# EAGLE design attiny84_tester-mk-1.0 (EAGLE 6.5.0)
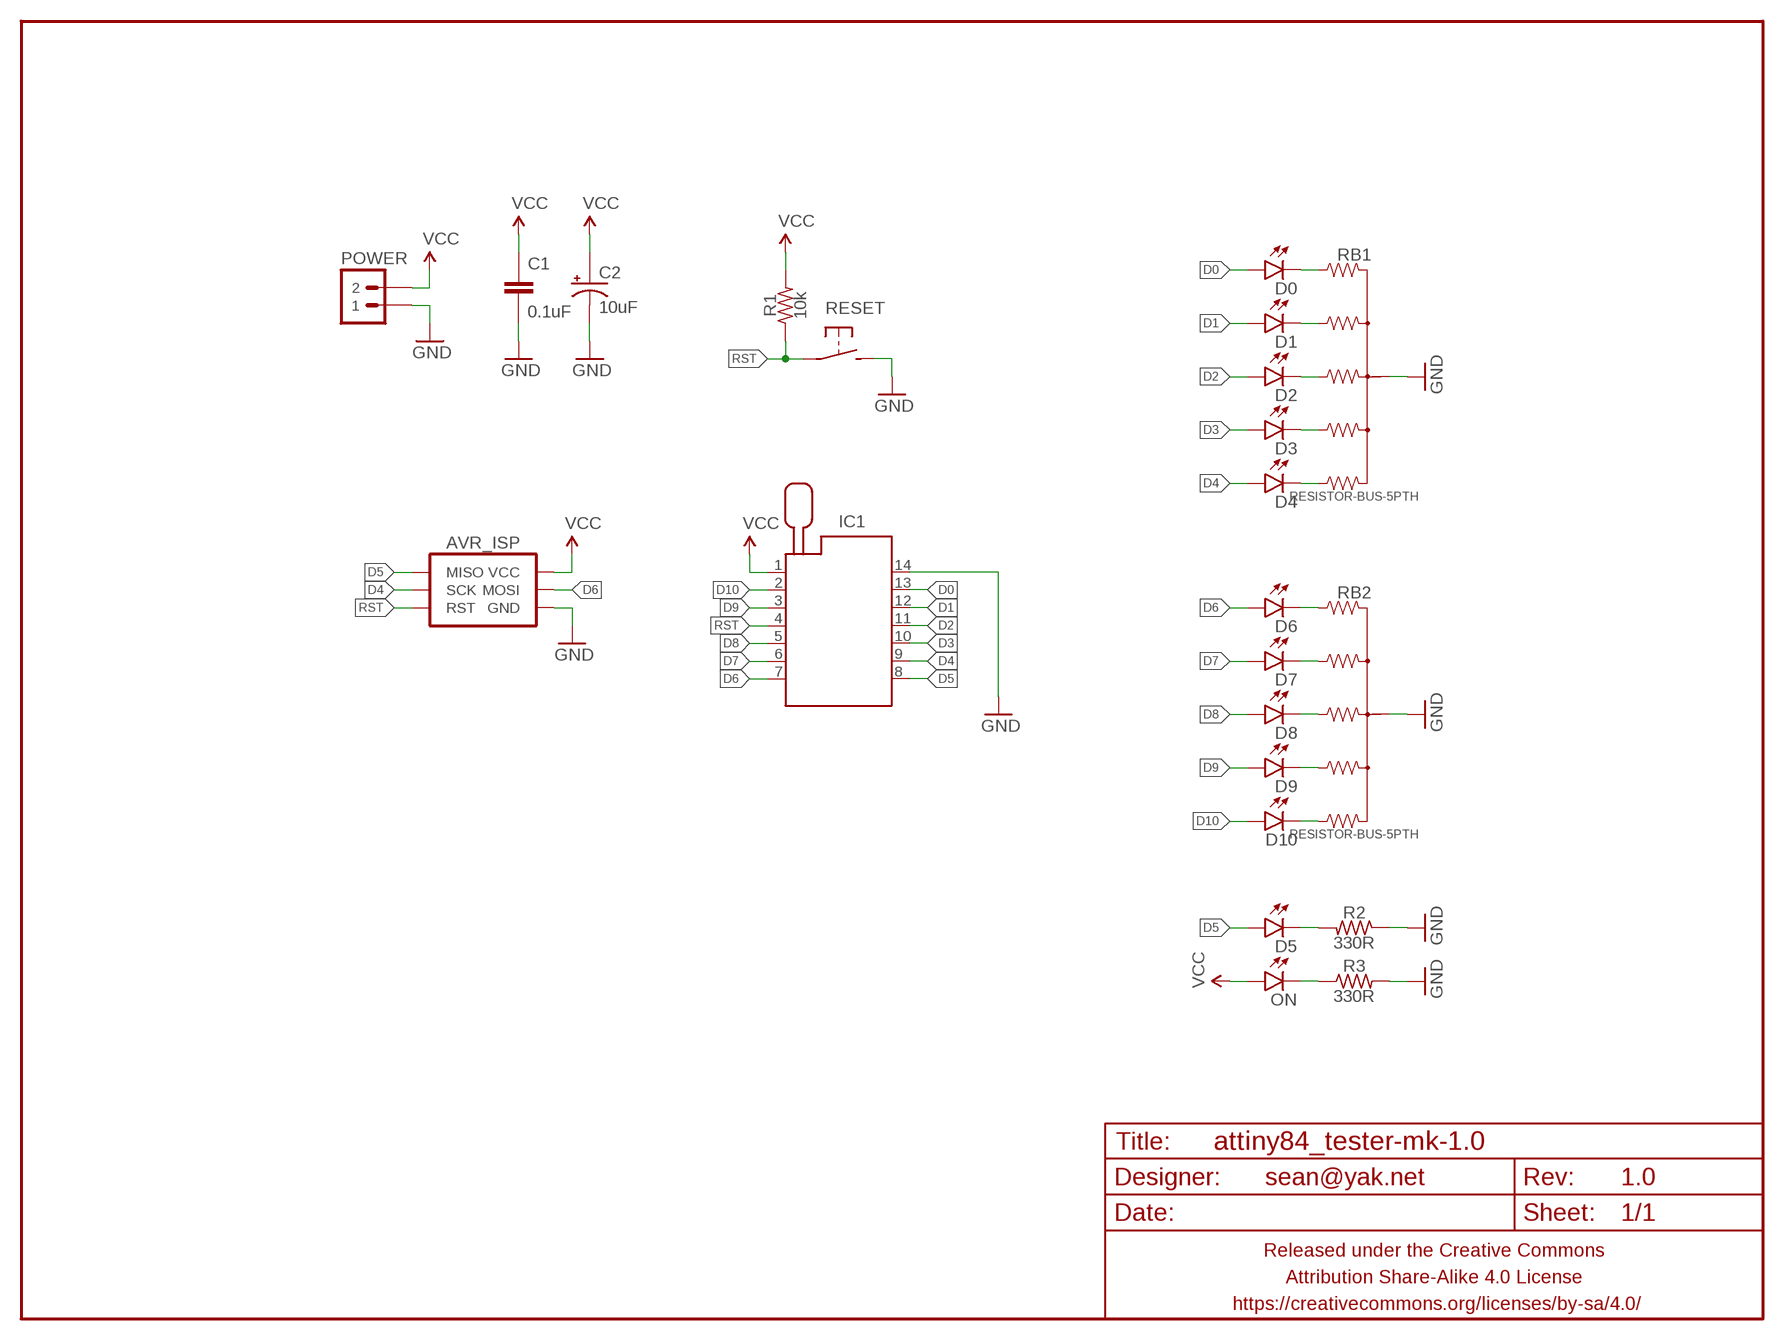
[diagram p0: schematic, sheet 1]

## Parts
AVR_ISP  AVR_SPI_PRG_6PTH-SHROUD  [2X3-SHROUDED]
C1  0.1uF  CAPACITOR-CERAMIC025-024X044  [C025-024X044]
C2  10uF  CAPACITOR-POLARIZEDE2-5  [E2-5]
D0  LED3MM-LESS  [LED3MM-LESSSILK]
D1  LED3MM-LESS  [LED3MM-LESSSILK]
D2  LED3MM-LESS  [LED3MM-LESSSILK]
D3  LED3MM-LESS  [LED3MM-LESSSILK]
D4  LED3MM-LESS  [LED3MM-LESSSILK]
D5  LED3MM-LESS  [LED3MM-LESSSILK]
D6  LED3MM-LESS  [LED3MM-LESSSILK]
D7  LED3MM-LESS  [LED3MM-LESSSILK]
D8  LED3MM-LESS  [LED3MM-LESSSILK]
D9  LED3MM-LESS  [LED3MM-LESSSILK]
D10  LED3MM-LESS  [LED3MM-LESSSILK]
FRAME1  FRAME-LETTERNO_PACKAGE  [DUMMY]
IC1  ATTiny84  ZIF14  [ZIF14]
ON  LED3MM-LESS  [LED3MM-LESSSILK]
POWER  M02PTH-CENTERED-R+  [1X02-CENTER-R+]
R1  10k  RESISTORPTH-AXIAL-5.08MM  [RESISTOR-AXIAL-PTH-5.08MM]
R2  330R  RESISTORPTH-AXIAL-5.08MM  [RESISTOR-AXIAL-PTH-5.08MM]
R3  330R  RESISTORPTH-AXIAL-5.08MM  [RESISTOR-AXIAL-PTH-5.08MM]
RB1  RESISTOR-BUS-5PTH  [1X06]
RB2  RESISTOR-BUS-5PTH  [1X06]
RESET  SPST-NO-TACT6MM-PTH-SMALL-PADS  [DTS-6-SMALL-PADS]

## Nets
D0: D0.A IC1.13
D1: D1.A IC1.12
D2: D2.A IC1.11
D3: D3.A IC1.10
D4: AVR_ISP.3(SCK) D4.A IC1.9
D5: AVR_ISP.1(MISO) D5.A IC1.8
D6: AVR_ISP.4(MOSI) D6.A IC1.7
D7: D7.A IC1.6
D8: D8.A IC1.5
D9: D9.A IC1.3
D10: D10.A IC1.2
GND: AVR_ISP.6(GND) C1.2 C2.- IC1.14 POWER.1 R2.P$1 R3.P$2 RB1.6(COM) RB2.6(COM) RESET.3 RESET.4
N$1: ON.K(C) R3.P$1
N$2: D0.K(C) RB1.1
N$3: D1.K(C) RB1.2
N$4: D2.K(C) RB1.3
N$5: D3.K(C) RB1.4
N$6: D4.K(C) RB1.5
N$7: D5.K(C) R2.P$2
N$8: D6.K(C) RB2.1
N$9: D7.K(C) RB2.2
N$10: D8.K(C) RB2.3
N$11: D9.K(C) RB2.4
N$12: D10.K(C) RB2.5
RST: AVR_ISP.5(RST) IC1.4 R1.P$1 RESET.1 RESET.2
VCC: AVR_ISP.2(VCC) C1.1 C2.+ IC1.1 ON.A POWER.2 R1.P$2

## Library data of the parts
AVR_ISP = A_butts:AVR_SPI_PRG_6: AVR ISP 6 Pin This is the reduced ISP connector for AVR programming. Common on Arduino. This footprint will take up less PCB space and can be used with a 10-pin to 6-pin adapter such as SKU: BOB-08508 **Special note about "TEST_POINT" package. The stop mask is on the top side, so if you want your programming test points to be on the bottom of your board, make sure to place this package on the bottom side of the board. This also ensure that the orientation to program from the bottom side will be correct.
C1 = A_butts:CAPACITOR-CERAMIC: CAPACITOR, European symbol
C2 = A_butts:CAPACITOR-POLARIZED: POLARIZED CAPACITOR, American symbol
D0 D1-D10 ON = A_butts:LED: LEDs Standard schematic elements and footprints for 5mm, 3mm, 1206, and 0603 sized LEDs. 5mm - Spark Fun Electronics SKU : COM-00529 (and others)
FRAME1 = A_butts:FRAME-LETTER: Schematic Frame Standard 8.5x11 US Letter frame; DESIGNER: sean@yak.net; VERSION: 1.0
IC1 = A_butts:ZIF14: Zero Insertion Force Socked Source: http://www.3M.com/ehpd; MF: 3M; MPN: 214-3339-00-0602J; OC_FARNELL: 1247151; OC_NEWARK: 85K7793
POWER = A_butts:M02: Standard 2-pin 0.1" header. Use with - straight break away headers ( PRT-00116) - right angle break away headers (PRT-00553) - swiss pins (PRT-00743) - machine pins (PRT-00117) - female headers (PRT-00115) Molex polarized connector foot print use with: PRT-08233 with associated crimp pins and housings. 2.54_SCREWTERM for use with PRT-10571. 3.5mm Screw Terminal footprints for PRT-08084 5mm Screw Terminal footprints for use with PRT-08433
R1-R3 = A_butts:RESISTOR: RESISTOR, American symbol
RB1 RB2 = A_butts:RESISTOR-BUS-5
RESET = A_butts:SPST-NO-TACT

## Board
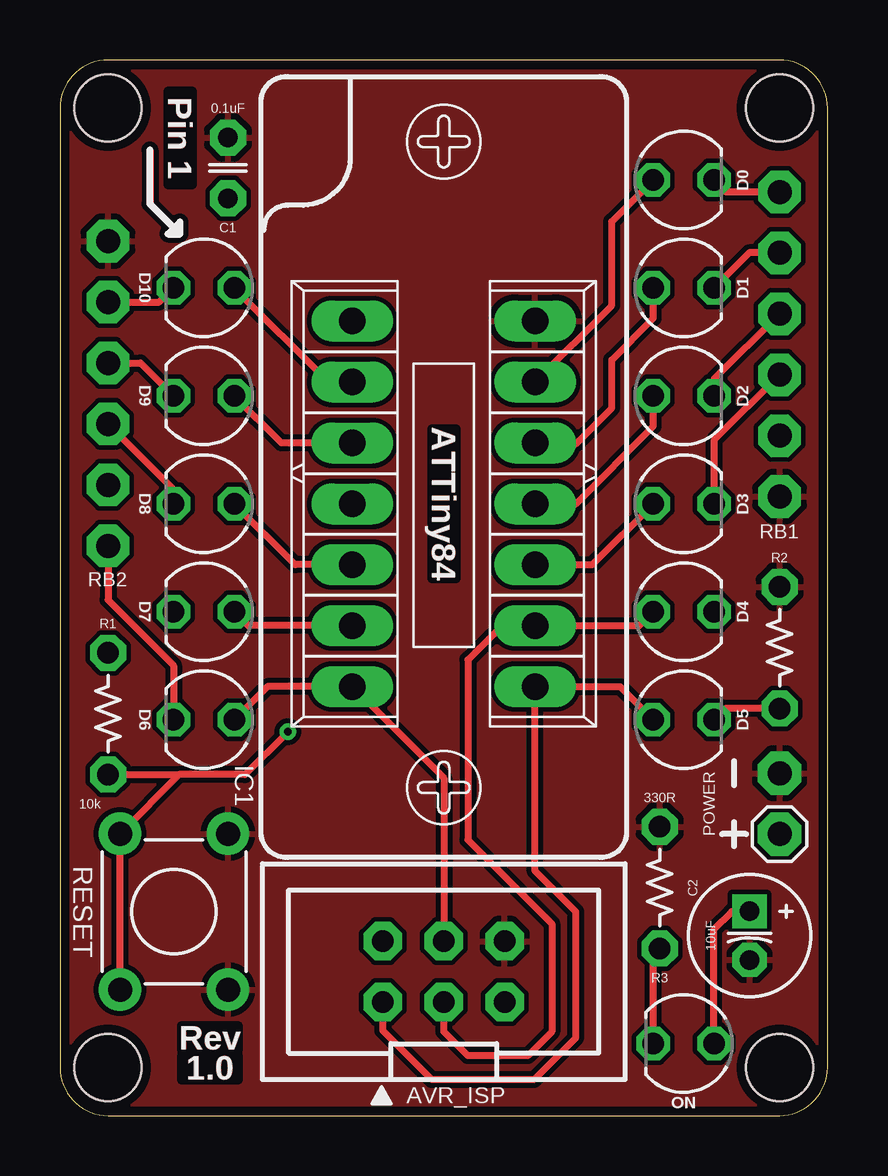
[diagram p1: board, top side]
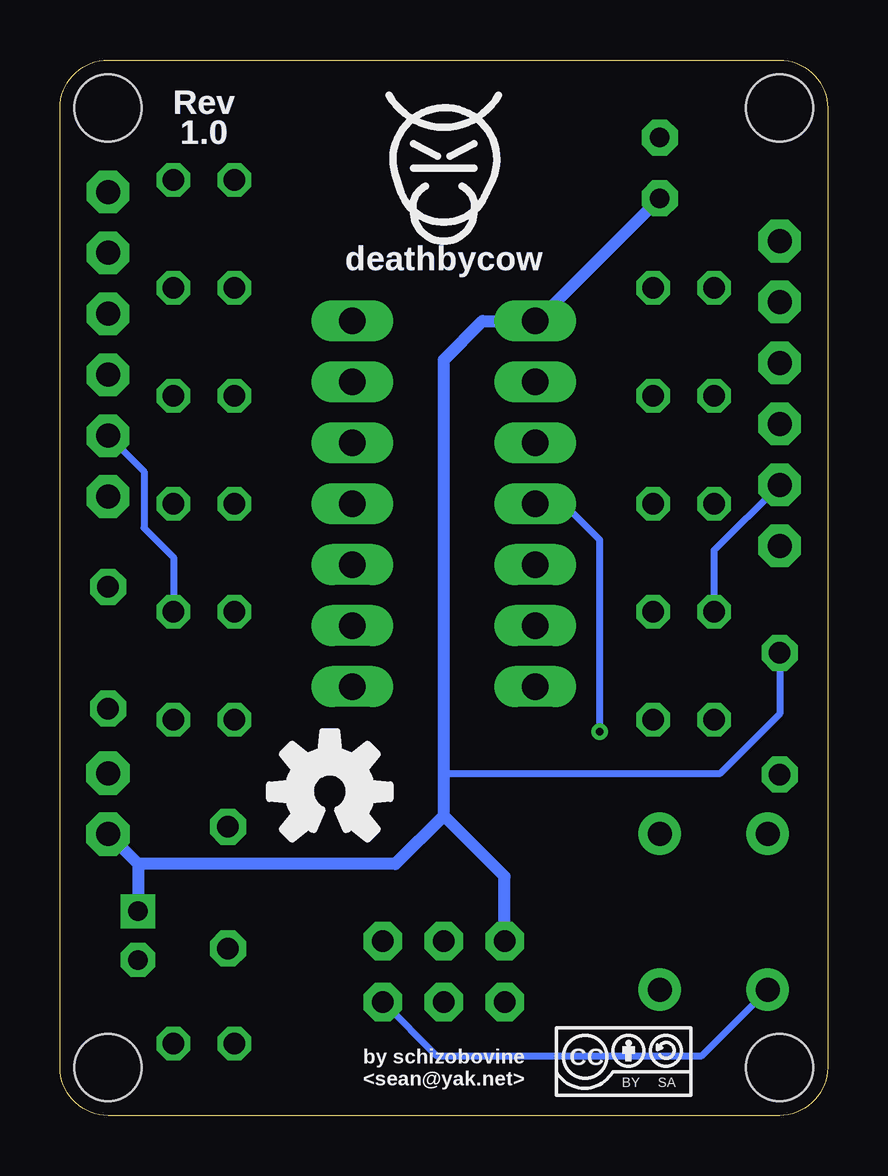
[diagram p2: board, bottom side, seen from below]

Size 32 x 44 mm. Coordinates in mm from the lower left corner, seen from the top.
Outline: 0,42 0,2 arc90 2,0 30,0 arc90 32,2 32,42 arc90 30,44 2,44 arc90 0,42
Copper layers (1*16): Top 0.0356mm / dielectric 1.5011mm / Bottom 0.0356mm
Design rules "LaenPCBOrder_2": minimum track width 6mil, minimum drill 13mil, track to track 6mil, track to pad 6mil, pad to pad 6mil, via to via 6mil, smd to smd 6mil, copper to edge 15mil, drill to drill 6mil, minimum pad ring 7mil, minimum via ring 7mil, stop-mask expansion 3mil, vias tented up to drill 20mil, thermal gap 10mil
Holes 2.8 mm at 2,2 30,2 30,42 2,42

### Footprints (pad centres in the part's own frame; a part is rotated, then mirrored left to right if it is on the bottom)
2X3-SHROUDED = drill 0.9 pad 1.6 octagon: 1 -1.27,2.54; 2 1.27,2.54; 3 -1.27,0; 4 1.27,0; 5 -1.27,-2.54; 6 1.27,-2.54
C025-024X044 = drill 0.813 pad 1.5 octagon: 1 -1.27,0; 2 1.27,0
E2-5 = drill 0.813 pad 1.422 square: + -1.016,0 | drill 0.813 pad 1.422 octagon: - 1.016,0
LED3MM-LESSSILK = drill 0.9 pad 1.4 octagon: A -1.27,0; K 1.27,0
ZIF14 = drill 1.1 pad 1.7 long: 1 -7.62,-3.81; 2 -5.08,-3.81; 3 -2.54,-3.81; 4 0,-3.81; 5 2.54,-3.81; 6 5.08,-3.81; 7 7.62,-3.81; 8 7.62,3.81; 9 5.08,3.81; 10 2.54,3.81; 11 0,3.81; 12 -2.54,3.81; 13 -5.08,3.81; 14 -7.62,3.81
1X02-CENTER-R+ = drill 1 pad 1.8 octagon: 1 -1.27,0; 2 1.27,0
RESISTOR-AXIAL-PTH-5.08MM = drill 0.9 pad 1.5 octagon: P$1 -2.54,0; P$2 2.54,0
1X06 = drill 1 pad 1.778 octagon: 1 0,0; 2 2.54,0; 3 5.08,0; 4 7.62,0; 5 10.16,0; 6 12.7,0
DTS-6-SMALL-PADS = drill 1 pad 1.778: 1 -3.25,2.25; 2 3.25,2.25; 3 -3.25,-2.25; 4 3.25,-2.25

### Placement (x,y rotation side)
AVR_ISP  16,6 90 top
C1  7,39.5 90 top
C2  28.75,7.5 270 top
D0  26,39 0 top
D1  26,34.5 0 top
D2  26,30 0 top
D3  26,25.5 0 top
D4  26,21 0 top
D5  26,16.5 0 top
D6  6,16.5 180 top
D7  6,21 180 top
D8  6,25.5 180 top
D9  6,30 180 top
D10  6,34.5 180 top
FRAME1  0.5,0.5 0 top
IC1  16,25.5 270 top
ON  26,3 180 top
POWER  30,13 270 top
R1  2,16.75 90 top
R2  30,19.5 270 top
R3  25,9.5 90 top
RB1  30,38.5 270 top
RB2  2,23.75 90 top
RESET  4.75,8.5 90 top
U$1  [COW_SMALL_METAL]  16,40 0 bottom
U$2  [CC-BY-SA-4.0-NO-URL]  8.5,2.25 0 bottom
U$3  [OSHWLOGO_BOT_0.2_A]  20.75,13.5 0 top

### Tracks (layer width: path | path; a pad name or v marks a point on that pad's centre or on a via)
D0
  Top 0.3: IC1.13 23,33.77 23,37.27 D0.A
D1
  Top 0.3: IC1.12 19.85,28 21.5,28 23,29.5 23,31.5 24.73,33.23 D1.A
D2
  Top 0.3: IC1.11 21.5,25.5 24.73,28.73 D2.A
D3
  Top 0.3: IC1.10 22.19,22.96 D3.A
D4
  Top 0.3: D4.A 24.15,20.42 IC1.9 19.73,20.5 18.5,20.5 17,19 17,11.5 20.5,8 20.5,3.5 19.5,2.5 17,2.5 16,3.5 AVR_ISP.3
D5
  Top 0.3: D5.A 23.35,17.88 IC1.8 19.81,10.19 21.5,8.5 21.5,3.25 19.75,1.5 15.5,1.5 13.46,3.54 AVR_ISP.1
D6
  Top 0.3: D6.A 8.65,17.88 IC1.7 16,14.07 AVR_ISP.4
D7
  Top 0.3: IC1.6 7.85,20.42 D7.A
D8
  Top 0.3: IC1.5 9.81,22.96 D8.A
D9
  Top 0.3: IC1.3 9.23,28.04 D9.A
D10
  Top 0.3: IC1.2 11.19,30.58 D10.A
GND
  pour Top (isolate 0.2): 0,42 0,2 arc90 2,0 30,0 arc90 32,2 32,42 arc90 30,44 2,44 arc90
N$1
  Top 0.3: ON.K 24.73,6.69 R3.P$1
N$2
  Top 0.3: RB1.1 27.77,38.5 D0.K
N$3
  Top 0.3: RB1.2 28.73,35.96 D1.K
N$4
  Top 0.3: D2.K 27.27,30.69 RB1.3
N$5
  Top 0.3: RB1.4 27.27,28.15 D3.K
N$6
  Bottom 0.3: RB1.5 28.5,26.84 28.5,24.5 27.27,23.27 D4.K
N$7
  Top 0.3: R2.P$2 27.73,16.96 D5.K
N$8
  Top 0.3: RB2.1 2,21.5 4.73,18.77 D6.K
N$9
  Bottom 0.3: RB2.2 4.73,23.56 D7.K
N$10
  Top 0.3: D8.K 4.73,26.1 RB2.3
N$11
  Top 0.3: RB2.4 3.36,31.37 D9.K
N$12
  Top 0.3: RB2.5 4.14,33.91 D10.K
N$13
  Top 0.3: 3.75,40.25 3.75,38 5,36.75 | 5,36.75 5,37.25 4.5,36.75 5,36.75
RST  (via drill 0.33)
  Top 0.3: RESET.1 RESET.2 4.96,14.21 | v9.5,16 7.71,14.21 4.96,14.21 | R1.P$1 4.96,14.21
  Bottom 0.3: v9.5,16 9.5,24 11,25.5 IC1.4 | AVR_ISP.5 16.31,2.5 5.25,2.5 RESET.1
VCC
  Top 0.3: ON.A 27.27,7.77 28,8.5 28.73,8.5 C2.+
  Bottom 0.3: R1.P$2 2,16.75 4.5,14.25 16,14.25
  Bottom 0.5: 16,12.5 16,14.25 16,31.5 14.38,33.12 IC1.1 12.11,33.12 C1.1 | AVR_ISP.2 13.46,9.96 16,12.5 | POWER.2 28.75,10.48 | 28.75,10.48 C2.+ | 16,12.5 18.02,10.48 28.75,10.48

### Text on the board
Top: Pin 1 | ATTiny84 | Rev
Bottom: Rev
tPlace: Pin 1 | Rev
bPlace: Rev | by schizobovine / <sean@yak.net>